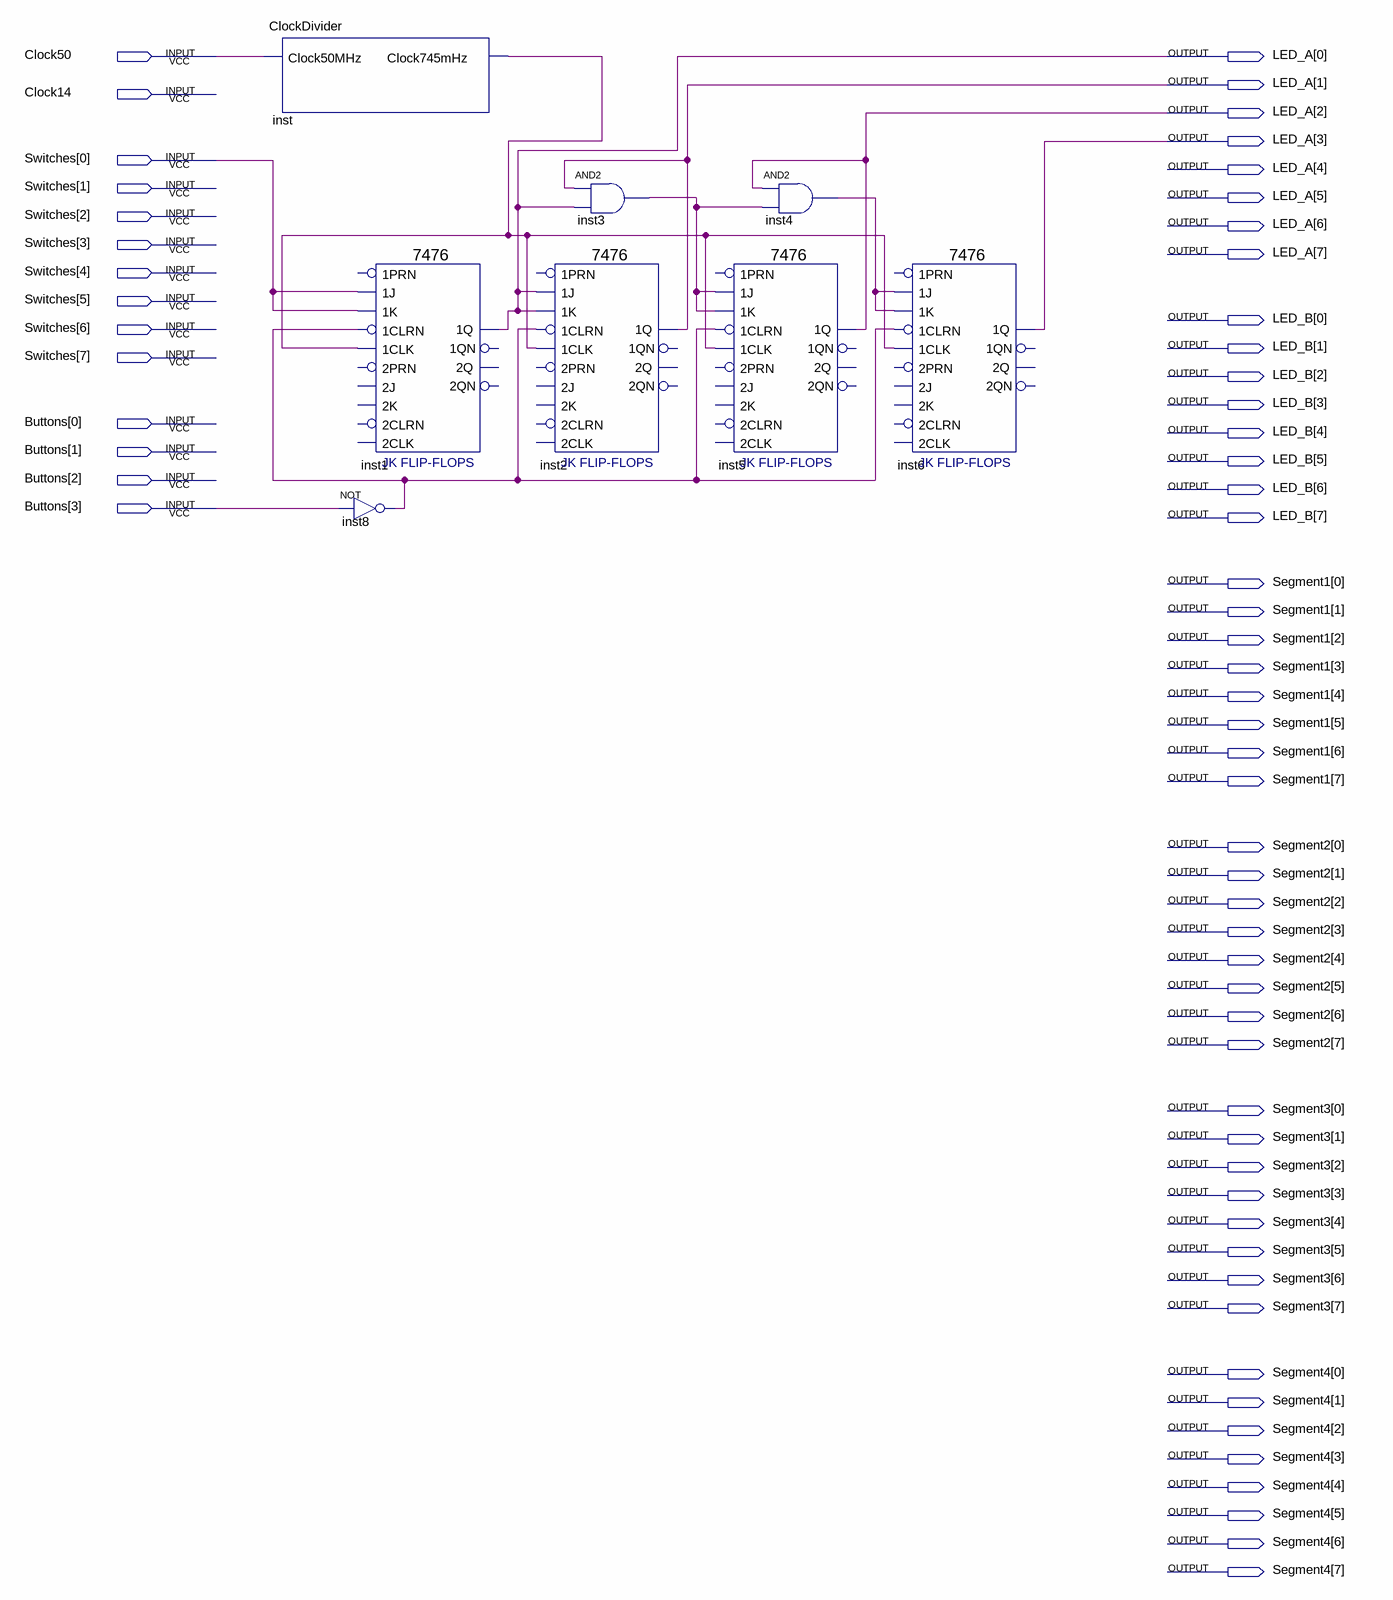
[diagram p0: schematic sheet]
// Quartus schematic 4BitSynchronzaehler.bdf as structural Verilog: 8 symbols, 62 pins
module \4BitSynchronzaehler  (
  input  Clock50,
  input  Clock14,
  input  [7:0] Switches,
  input  [3:0] Buttons,
  output [7:0] LED_A,
  output [7:0] LED_B,
  output [7:0] Segment1,
  output [7:0] Segment2,
  output [7:0] Segment3,
  output [7:0] Segment4
);

  wire inst3_out, inst4_out, inst8_out, inst_clock745mhz;

  ClockDivider inst (.Clock50MHz(Clock50), .Clock745mHz(inst_clock745mhz));
  \7476  inst1 (
    .\1J (Switches[0]), .\1K (Switches[0]), .\1CLK (inst_clock745mhz), .\1CLRN (inst8_out), .\1Q (LED_A[0]));  // open: 1PRN, 2PRN, 2J, 2K, 2CLRN, 2CLK, 2QN, 2Q, 1QN
  not inst8 (inst8_out, Buttons[3]);
  \7476  inst2 (
    .\1J (LED_A[0]), .\1K (LED_A[0]), .\1CLK (inst_clock745mhz), .\1CLRN (inst8_out), .\1Q (LED_A[1]));  // open: 1PRN, 2PRN, 2J, 2K, 2CLRN, 2CLK, 2QN, 2Q, 1QN
  and inst3 (inst3_out, LED_A[1], LED_A[0]);
  and inst4 (inst4_out, LED_A[2], inst3_out);
  \7476  inst5 (
    .\1J (inst3_out), .\1K (inst3_out), .\1CLK (inst_clock745mhz), .\1CLRN (inst8_out), .\1Q (LED_A[2]));  // open: 1PRN, 2PRN, 2J, 2K, 2CLRN, 2CLK, 2QN, 2Q, 1QN
  \7476  inst6 (
    .\1J (inst4_out), .\1K (inst4_out), .\1CLK (inst_clock745mhz), .\1CLRN (inst8_out), .\1Q (LED_A[3]));  // open: 1PRN, 2PRN, 2J, 2K, 2CLRN, 2CLK, 2QN, 2Q, 1QN
endmodule
